# EAGLE design tile-controller (EAGLE 8.6.0)
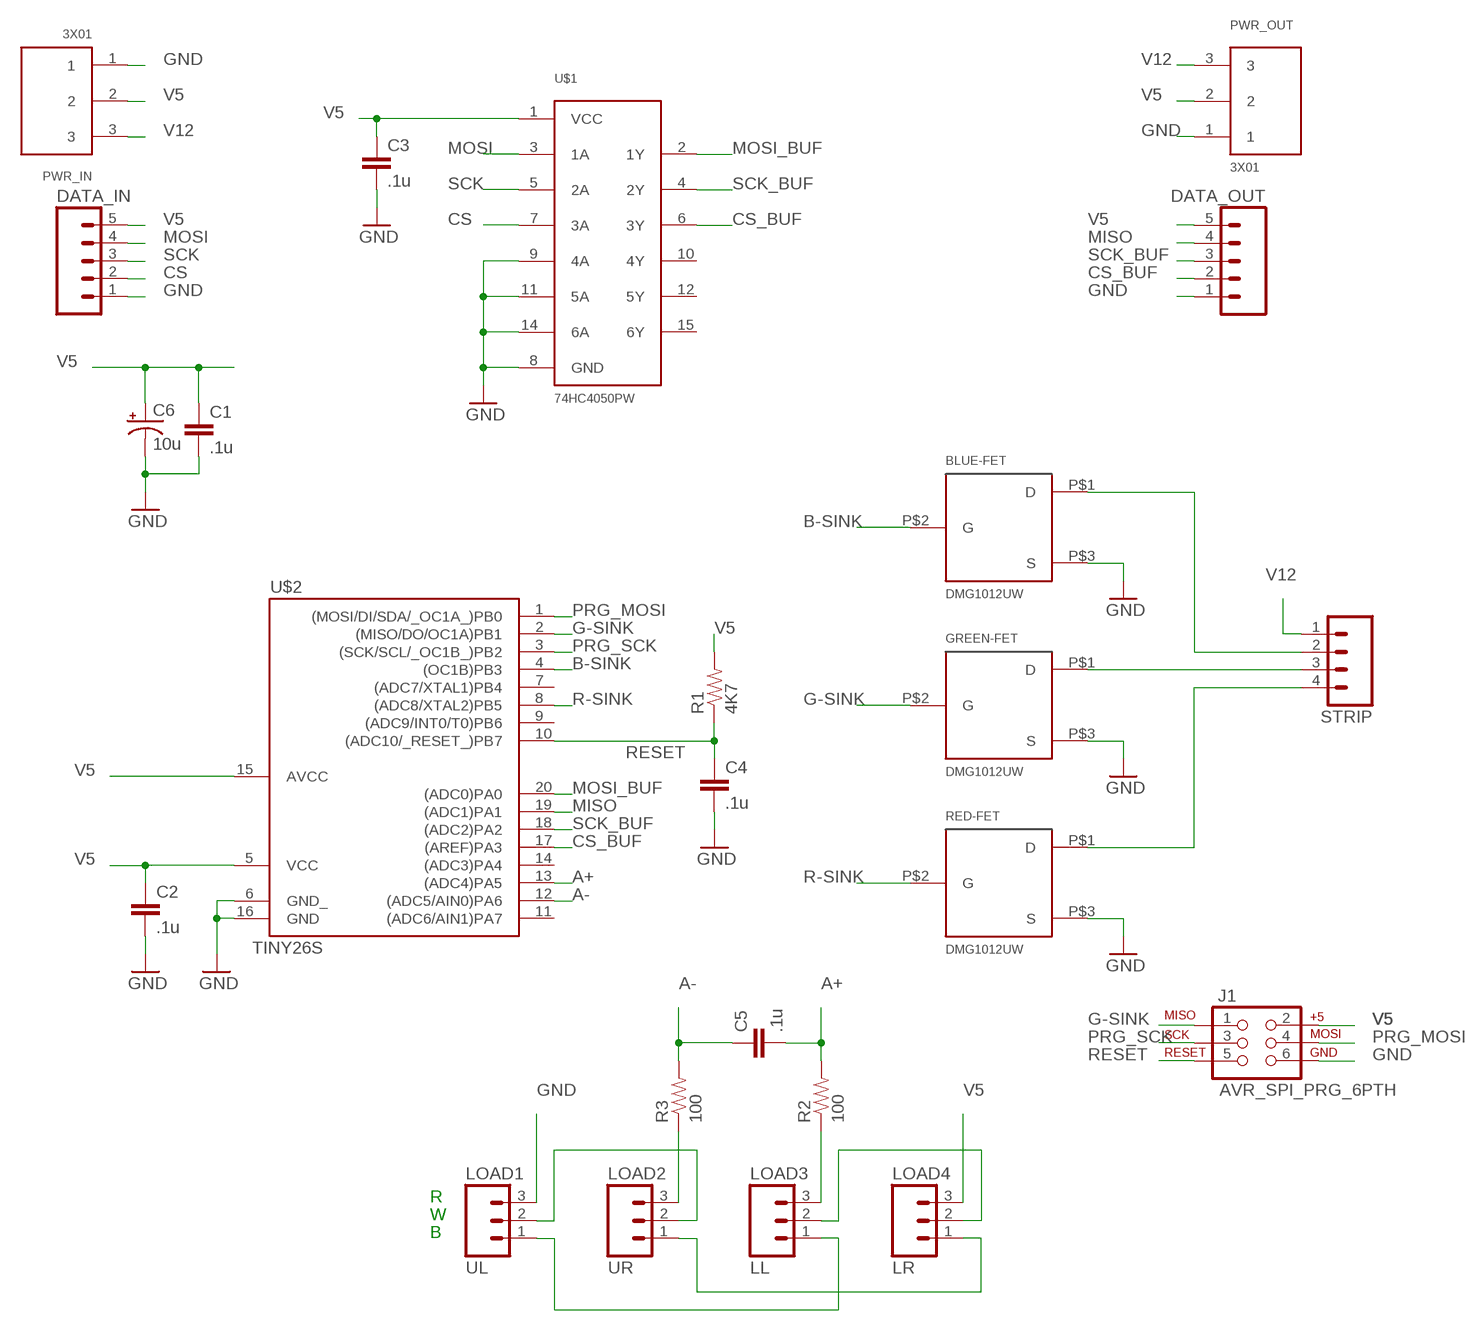
[diagram p0: schematic, sheet 1]

## Parts
BLUE-FET  DMG1012UW  [SOT-323]
C1  .1u  CAP0805  [0805]
C2  .1u  CAP0805  [0805]
C3  .1u  CAP0805  [0805]
C4  .1u  CAP0805  [0805]
C5  .1u  CAP0805  [0805]
C6  10u  CAP_POL1206  [EIA3216]
DATA_IN  M05PTH  [1X05]
DATA_OUT  M05PTH  [1X05]
GREEN-FET  DMG1012UW  [SOT-323]
J1  AVR_SPI_PRG_6PTH  [2X3]
LOAD1  UL  M03PTH  [1X03]
LOAD2  UR  M03PTH  [1X03]
LOAD3  LL  M03PTH  [1X03]
LOAD4  LR  M03PTH  [1X03]
PWR_IN  3X01  [3X01-18AWG]
PWR_OUT  3X01  [3X01-18AWG]
R1  4K7  RESISTOR  [0805]
R2  100  RESISTOR  [0805]
R3  100  RESISTOR  [0805]
RED-FET  DMG1012UW  [SOT-323]
STRIP  M04PTH  [1X04]
U$1  74HC4050PW  [TSSOP16.2]
U$2  TINY26S  [SO20L$]

## Nets
_1: LOAD2.3 R3.1
_2: LOAD3.3 R2.1
A+: C5.2 R2.2 U$2.13((ADC4)PA5)
A-: C5.1 R3.2 U$2.12((ADC5/AIN0)PA6)
B-SINK: BLUE-FET.P$2(G) U$2.4((OC1B)PB3)
CS: DATA_IN.2 U$1.7(3A)
CS_BUF: DATA_OUT.2 U$1.6(3Y) U$2.17((AREF)PA3)
G-SINK: GREEN-FET.P$2(G) J1.1 U$2.2((MISO/DO/OC1A)PB1)
GND: BLUE-FET.P$3(S) C1.2 C2.2 C3.2 C4.2 C6.C(-) DATA_IN.1 DATA_OUT.1 GREEN-FET.P$3(S) J1.6 LOAD1.3 PWR_IN.1 PWR_OUT.1 RED-FET.P$3(S) U$1.8(GND) U$1.9(4A) U$1.11(5A) U$1.14(6A) U$2.6(GND_) U$2.16(GND)
MISO: DATA_OUT.4 U$2.19((ADC1)PA1)
MOSI: DATA_IN.4 U$1.3(1A)
MOSI_BUF: U$1.2(1Y) U$2.20((ADC0)PA0)
N$2: LOAD1.1 LOAD3.1
N$3: LOAD2.1 LOAD4.1
N$4: GREEN-FET.P$1(D) STRIP.3
N$5: BLUE-FET.P$1(D) STRIP.2
N$6: RED-FET.P$1(D) STRIP.4
N$7: LOAD1.2 LOAD2.2
N$8: LOAD3.2 LOAD4.2
PRG_MOSI: J1.4 U$2.1((MOSI/DI/SDA/_OC1A_)PB0)
PRG_SCK: J1.3 U$2.3((SCK/SCL/_OC1B_)PB2)
R-SINK: RED-FET.P$2(G) U$2.8((ADC8/XTAL2)PB5)
RESET: C4.1 J1.5 R1.1 U$2.10((ADC10/_RESET_)PB7)
SCK: DATA_IN.3 U$1.5(2A)
SCK_BUF: DATA_OUT.3 U$1.4(2Y) U$2.18((ADC2)PA2)
V5: C1.1 C2.1 C3.1 C6.A(+) DATA_IN.5 DATA_OUT.5 J1.2 LOAD4.3 PWR_IN.2 PWR_OUT.2 R1.2 U$1.1(VCC) U$2.5(VCC) U$2.15(AVCC)
V12: PWR_IN.3 PWR_OUT.3 STRIP.1
Unconnected: U$1.10(4Y) U$1.12(5Y) U$1.15(6Y) U$2.7((ADC7/XTAL1)PB4) U$2.9((ADC9/INT0/T0)PB6) U$2.11((ADC6/AIN1)PA7) U$2.14((ADC3)PA4)

## Notes on the sheet
- R
- W
- B

## Library data of the parts
BLUE-FET GREEN-FET RED-FET = GARTH:DMG1012UW: N-CHANNEL ENHANCEMENT MODE MOSFET
C1-C5 = SparkFun:CAP: Capacitor Standard 0603 ceramic capacitor, and 0.1" leaded capacitor.
C6 = SparkFun:CAP_POL: Capacitor Polarized These are standard SMD and PTH capacitors. Normally 10uF, 47uF, and 100uF in electrolytic and tantalum varieties. Always verify the external diameter of the through hole cap, it varies with capacity, voltage, and manufacturer. The EIA devices should be standard.
DATA_IN DATA_OUT = SparkFun-Connectors:M05: Header 5 Standard 5-pin 0.1" header. Use with straight break away headers (SKU : PRT-00116), right angle break away headers (PRT-00553), swiss pins (PRT-00743), machine pins (PRT-00117), and female headers (PRT-00115). Molex polarized connector foot print use with SKU : PRT-08230 with associated crimp pins and housings.
J1 = SparkFun-Connectors:AVR_SPI_PRG_6: AVR ISP 6 Pin This is the reduced ISP connector for AVR programming. Common on Arduino. This footprint will take up less PCB space and can be used with a 10-pin to 6-pin adapter such as SKU: BOB-08508
LOAD1-LOAD4 = SparkFun-Connectors:M03: Header 3 Standard 3-pin 0.1" header. Use with straight break away headers (SKU : PRT-00116), right angle break away headers (PRT-00553), swiss pins (PRT-00743), machine pins (PRT-00117), and female headers (PRT-00115). Molex polarized connector foot print use with SKU : PRT-08232 with associated crimp pins and housings.
PWR_IN PWR_OUT = GARTH:3X01
R1-R3 = SparkFun:RESISTOR: Resistor Basic schematic elements and footprints for 0603, 1206, and PTH 1/10th watt (small) resistors.
STRIP = SparkFun-Connectors:M04: Header 4 Standard 4-pin 0.1" header. Use with straight break away headers (SKU : PRT-00116), right angle break away headers (PRT-00553), swiss pins (PRT-00743), machine pins (PRT-00117), and female headers (PRT-00115). Molex polarized connector foot print use with SKU : PRT-08231 with associated crimp pins and housings. 1MM SMD Version SKU: PRT-10208
U$1 = GARTH:74HC4050: High-Speed CMOS Logic, Non-Inverting Hex Buffers
U$2 = avr-7:TINY26: Atmel Tiny26/261/461/861

## Board
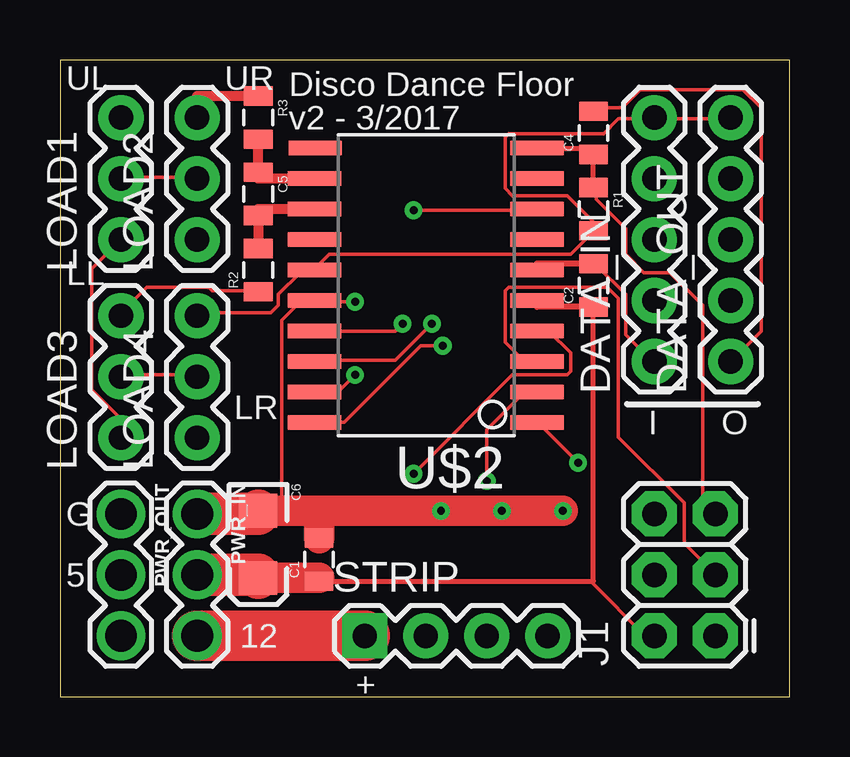
[diagram p1: board, top side]
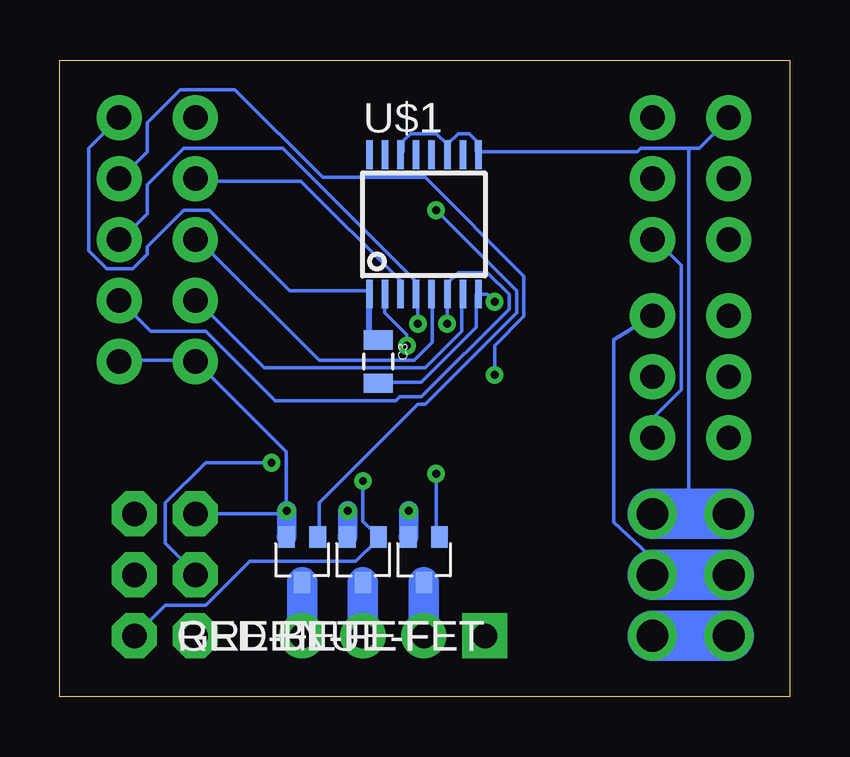
[diagram p2: board, bottom side, seen from below]

Size 30.4 x 26.53 mm. Coordinates in mm from the lower left corner, seen from the top.
Outline: 0,0 30.4,0 30.4,26.53 0,26.53 0,0
Copper layers (1*16): Top 0.035mm / dielectric 1.5mm / Bottom 0.035mm
Design rules "default *": minimum track width 6mil, minimum drill 13mil, track to track 6mil, track to pad 6mil, pad to pad 6mil, via to via 6mil, smd to smd 6mil, copper to edge 40mil, drill to drill 8mil, minimum pad ring 10mil, minimum via ring 8mil, stop-mask expansion 4mil, vias tented up to drill 0mil, thermal gap 10mil

### Footprints (pad centres in the part's own frame; a part is rotated, then mirrored left to right if it is on the bottom)
SOT-323 = smd 0.7 x 0.9: P$1 0,0.95; P$2 -0.65,-0.95; P$3 0.65,-0.95
0805 = smd 0.8 x 1.2: 1 -0.9,0; 2 0.9,0
EIA3216 = smd 1.4 x 1.6: A 1.4,0; C -1.4,0
1X05 = drill 1.016 pad 1.88: 1 0,0; 2 2.54,0; 3 5.08,0; 4 7.62,0; 5 10.16,0
2X3 = drill 1.016 pad 1.88 octagon: 1 0,0; 2 0,2.54; 3 2.54,0; 4 2.54,2.54; 5 5.08,0; 6 5.08,2.54
1X03 = drill 1.016 pad 1.88: 1 0,0; 2 2.54,0; 3 5.08,0
3X01-18AWG = drill 1.321 pad 2.032: 1 0,0; 2 2.54,0; 3 5.08,0
1X04 = drill 1.016 pad 1.88 square: 1 0,0 | drill 1.016 pad 1.88: 2 2.54,0; 3 5.08,0; 4 7.62,0
TSSOP16.2 = smd 0.27 x 1.2: 1 -2.275,-2.9; 2 -1.625,-2.9; 3 -0.975,-2.9; 4 -0.325,-2.9; 5 0.325,-2.9; 6 0.975,-2.9; 7 1.625,-2.9; 8 2.275,-2.9; 9 2.275,2.9; 10 1.625,2.9; 11 0.975,2.9; 12 0.325,2.9; 13 -0.325,2.9; 14 -0.975,2.9; 15 -1.625,2.9; 16 -2.275,2.9
SO20L$ = smd 0.61 x 2.21: 1 -5.715,-4.636; 2 -4.445,-4.636; 3 -3.175,-4.636; 4 -1.905,-4.636; 5 -0.635,-4.636; 6 0.635,-4.636; 7 1.905,-4.636; 8 3.175,-4.636; 9 4.445,-4.636; 10 5.715,-4.636; 11 5.715,4.61; 12 4.445,4.636; 13 3.175,4.636; 14 1.905,4.636; 15 0.635,4.636; 16 -0.635,4.636; 17 -1.905,4.636; 18 -3.175,4.636; 19 -4.445,4.636; 20 -5.715,4.636

### Placement (x,y rotation side)
BLUE-FET  15.24,5.71 180 bottom
C1  10.79,5.71 90 top
C2  22.23,17.14 90 top
C3  17.14,13.97 270 bottom
C4  22.23,23.5 90 top
C5  8.26,20.95 270 top
C6  8.26,6.35 270 top
DATA_IN  24.77,13.97 90 top
DATA_OUT  27.94,13.97 90 top
GREEN-FET  17.78,5.71 180 bottom
J1  27.3,2.54 90 top
LOAD1  2.54,19.05 90 top
LOAD2  5.71,19.05 90 top
LOAD3  2.54,10.79 90 top
LOAD4  5.71,10.79 90 top
PWR_IN  5.71,7.62 270 top
PWR_OUT  2.54,7.62 270 top
R1  22.23,20.32 270 top
R2  8.26,17.78 90 top
R3  8.26,24.13 270 top
RED-FET  20.32,5.71 180 bottom
STRIP  12.7,2.54 0 top
U$1  15.24,19.68 0 bottom
U$2  15.24,17.14 90 top

### Tracks (layer width: path | path; a pad name or v marks a point on that pad's centre or on a via)
_1
  Top 0.406: R3.1 5.71,25.03 LOAD2.3
_2
  Top 0.152: R2.1 8.18,16.92 6.35,16.92 6.2,17.07 3.61,17.07 2.54,16 LOAD3.3
A+
  Top 0.406: U$2.13 8.26,20.32 C5.2 R2.2
A-
  Top 0.406: U$2.12 8.26,21.59 C5.1 R3.2
B-SINK  (via drill 0.33)
  Top 0.152: v14.73,9.3 18.85,13.41 21.13,13.41 21.29,13.56 21.29,14.33 20.37,15.24 U$2.4
  Bottom 0.152: v14.73,9.3 14.73,6.71 BLUE-FET.P$2
CS
  Bottom 0.152: U$1.7 13.66,16.76 13.66,15.24 15.19,13.72 21.89,13.72 24.64,16.46 DATA_IN.2
CS_BUF  (via drill 0.33)
  Top 0.152: U$2.17 13.97,15.24 v14.28,15.54
  Bottom 0.152: DATA_OUT.2 27.84,16.46 26.62,15.24 24.33,15.24 21.44,12.34 16.41,12.34 16.26,12.5 15.34,12.5 11.68,16.15 11.68,16.76 12.6,17.68 13.82,17.68 14.28,17.22 14.28,16.92 U$1.6 14.28,16.76 v14.28,15.54
G-SINK  (via drill 0.33)
  Top 0.152: v17.78,8.99 17.78,11.12 19.3,12.65 19.76,12.65 U$2.2
  Bottom 0.152: J1.1 27.23,2.59 26.01,3.81 24.33,3.81 22.5,5.64 18.09,5.64 17.17,6.55 GREEN-FET.P$2 17.17,6.71 17.78,7.32 v17.78,8.99
GND  (via drill 0.33)
  Top 0.152: C2.2 22.35,17.98 23.57,16.76 23.57,15.09 24.64,14.02 DATA_IN.1 | DATA_OUT.1 29.21,15.24 29.21,24.54 28.45,25.3 24.18,25.3 23.42,24.54 22.35,24.54 C4.2 | 9.25,7.75 9.25,15.7 10.01,16.46 10.46,16.46 U$2.16 10.62,16.46 v12.29,16.46
  Top 0.203: 10.79,7.62 10.79,7.75
  Top 0.254: C2.2 19.88,18.05 U$2.6
  Top 1.27: 10.79,7.62 C1.2 | 10.79,7.75 v15.88,7.75 v18.41,7.75 v20.95,7.75 | C6.C 9.25,7.75 10.79,7.75
  Top 1.778: PWR_IN.1 8.26,7.62 C6.C
  Bottom 0.152: 6.5,7.32 PWR_IN.1 | DATA_OUT.1 27.84,14.02 24.79,14.02 DATA_IN.1 24.64,13.87 20.98,10.21 20.98,8.08 v20.95,7.75 21.29,7.62 J1.6 | 14.28,23.01 13.82,23.47 13.36,23.47 13.06,23.16 13.06,22.71 U$1.9 12.9,22.71 6.35,22.71 6.2,22.86 4.22,22.86 | 14.28,23.01 14.28,22.71 U$1.11 14.28,23.01 | 14.28,23.01 14.73,23.47 15.8,23.47 16.1,23.16 16.1,22.71 U$1.14 | 4.22,22.86 3.76,22.86 2.54,24.08 LOAD1.3 | C3.2 17.02,13.11 15.34,13.11 13.06,15.39 13.06,16.76 U$1.8 12.9,16.76 12.6,16.76 v12.29,16.46 | 4.22,7.62 4.22,22.86
  Bottom 0.813: BLUE-FET.P$3 15.88,6.67 v15.88,7.75 | GREEN-FET.P$3 18.41,6.67 v18.41,7.75 | RED-FET.P$3 20.95,6.67 v20.95,7.75
  Bottom 2.1: PWR_OUT.1 4.22,7.62 PWR_IN.1
MISO  (via drill 0.33)
  Top 0.152: v12.29,13.41 11.68,12.8 10.62,12.8 U$2.19
  Bottom 0.152: v12.29,13.41 12.29,14.63 11.07,15.85 11.07,17.53 15.19,21.64 19.46,21.64 23.11,25.3 25.4,25.3 26.77,23.93 26.77,22.71 27.84,21.64 DATA_OUT.4
MOSI
  Bottom 0.152: U$1.3 16.26,16.92 16.26,17.37 20.37,21.49 24.64,21.49 DATA_IN.4
MOSI_BUF  (via drill 0.33)
  Top 0.152: v15.95,14.63 15.04,14.63 11.84,11.43 U$2.20
  Bottom 0.152: v15.95,14.63 15.95,15.09 16.87,16 16.87,16.76 U$1.2
N$2
  Top 0.152: LOAD3.1 2.54,11.58 1.32,12.8 1.32,17.83 LOAD1.1
N$3
  Bottom 0.152: LOAD4.1 5.59,10.82 5.59,11.73 4.52,12.8 4.52,17.98 5.59,19.05 LOAD2.1
N$4
  Bottom 1.27: GREEN-FET.P$1 STRIP.3
N$5
  Bottom 1.27: BLUE-FET.P$1 STRIP.2
N$6
  Bottom 1.27: RED-FET.P$1 STRIP.4
N$7
  Top 0.152: LOAD1.2 2.54,21.64 5.59,21.64 LOAD2.2
N$8
  Top 0.152: LOAD3.2 2.54,13.41 5.59,13.41 LOAD4.2
PRG_MOSI  (via drill 0.33)
  Top 0.152: v21.59,9.75 19.91,11.43 U$2.1
  Bottom 0.152: v21.59,9.75 24.33,9.75 26.01,8.08 26.01,6.4 24.79,5.18 J1.4
PRG_SCK
  Top 0.152: U$2.3 19.76,14.02 19.3,14.02 18.54,14.78 18.54,16.92 18.69,17.07 22.81,17.07 23.27,16.61 23.27,10.82 26.01,8.08 26.01,6.4 27.23,5.18 J1.3
R-SINK  (via drill 0.33)
  Top 0.152: v14.73,20.27 19.76,20.27 U$2.8
  Bottom 0.152: v14.73,20.27 11.38,16.92 11.38,16 15.19,12.19 15.49,12.19 19.61,8.08 19.61,6.71 RED-FET.P$2
RESET
  Top 0.152: R1.1 22.35,21.18 22.35,20.73 23.57,19.51 23.57,18.44 24.33,17.68 25.4,17.68 26.77,16.31 26.77,8.08 27.23,7.62 J1.5
  Top 0.203: U$2.10 22.23,22.86 C4.1 R1.1
SCK
  Bottom 0.152: U$1.5 14.88,16.76 14.88,14.78 15.65,14.02 19.61,14.02 24.64,19.05 DATA_IN.3
SCK_BUF  (via drill 0.33)
  Top 0.152: v15.49,15.54 13.97,14.02 10.62,14.02 U$2.18
  Bottom 0.152: DATA_OUT.3 27.84,19.05 26.77,20.12 26.77,21.34 25.25,22.86 21.13,22.86 15.65,17.37 15.65,16.92 U$1.4 15.49,16.76 v15.49,15.54
V5
  Top 0.152: DATA_OUT.5 27.84,24.08 24.79,24.08 DATA_IN.5 24.64,24.08 23.27,24.08 22.66,23.47 18.69,23.47 18.54,23.32 18.54,21.18 18.85,20.88 21.13,20.88 22.2,19.81 22.2,19.51 R1.2 22.2,19.36 21.29,18.44 11.23,18.44 10.62,17.83 U$2.15 10.46,17.68 10.01,17.68 9.09,16.76 9.09,16.31 8.79,16 5.74,16 LOAD4.3 | J1.2 24.64,2.59 24.33,2.59 22.2,4.72 22.2,4.82
  Top 0.203: C1.1 22.2,4.82 22.23,4.82 C2.1
  Top 0.254: C2.1 19.88,16.25 U$2.5
  Top 0.406: 10.79,4.95 C1.1
  Top 1.27: C6.A 10.79,4.95
  Top 1.778: PWR_IN.2 8.26,5.08 C6.A
  Bottom 0.152: DATA_OUT.5 29.21,22.86 29.21,18.59 28.45,17.83 27.38,17.83 26.77,18.44 26.77,18.75 25.25,20.27 24.18,20.27 20.83,16.92 17.63,16.92 U$1.1 | LOAD4.3 7.34,14.88 7.34,7.26 5.89,5.94 PWR_IN.2
  Bottom 0.254: C3.1 17.52,14.87 U$1.1
  Bottom 2.1: PWR_OUT.2 PWR_IN.2
V12
  Top 2.1: PWR_IN.3 STRIP.1
  Bottom 2.1: PWR_OUT.3 PWR_IN.3

### Text on the board
tPlace: UL | UR | Disco Dance Floor | v2 - 3/2017 | LL | LR | I | O | G | 5 | 12 | +